# EAGLE design powerboard (EAGLE 7.6.0)
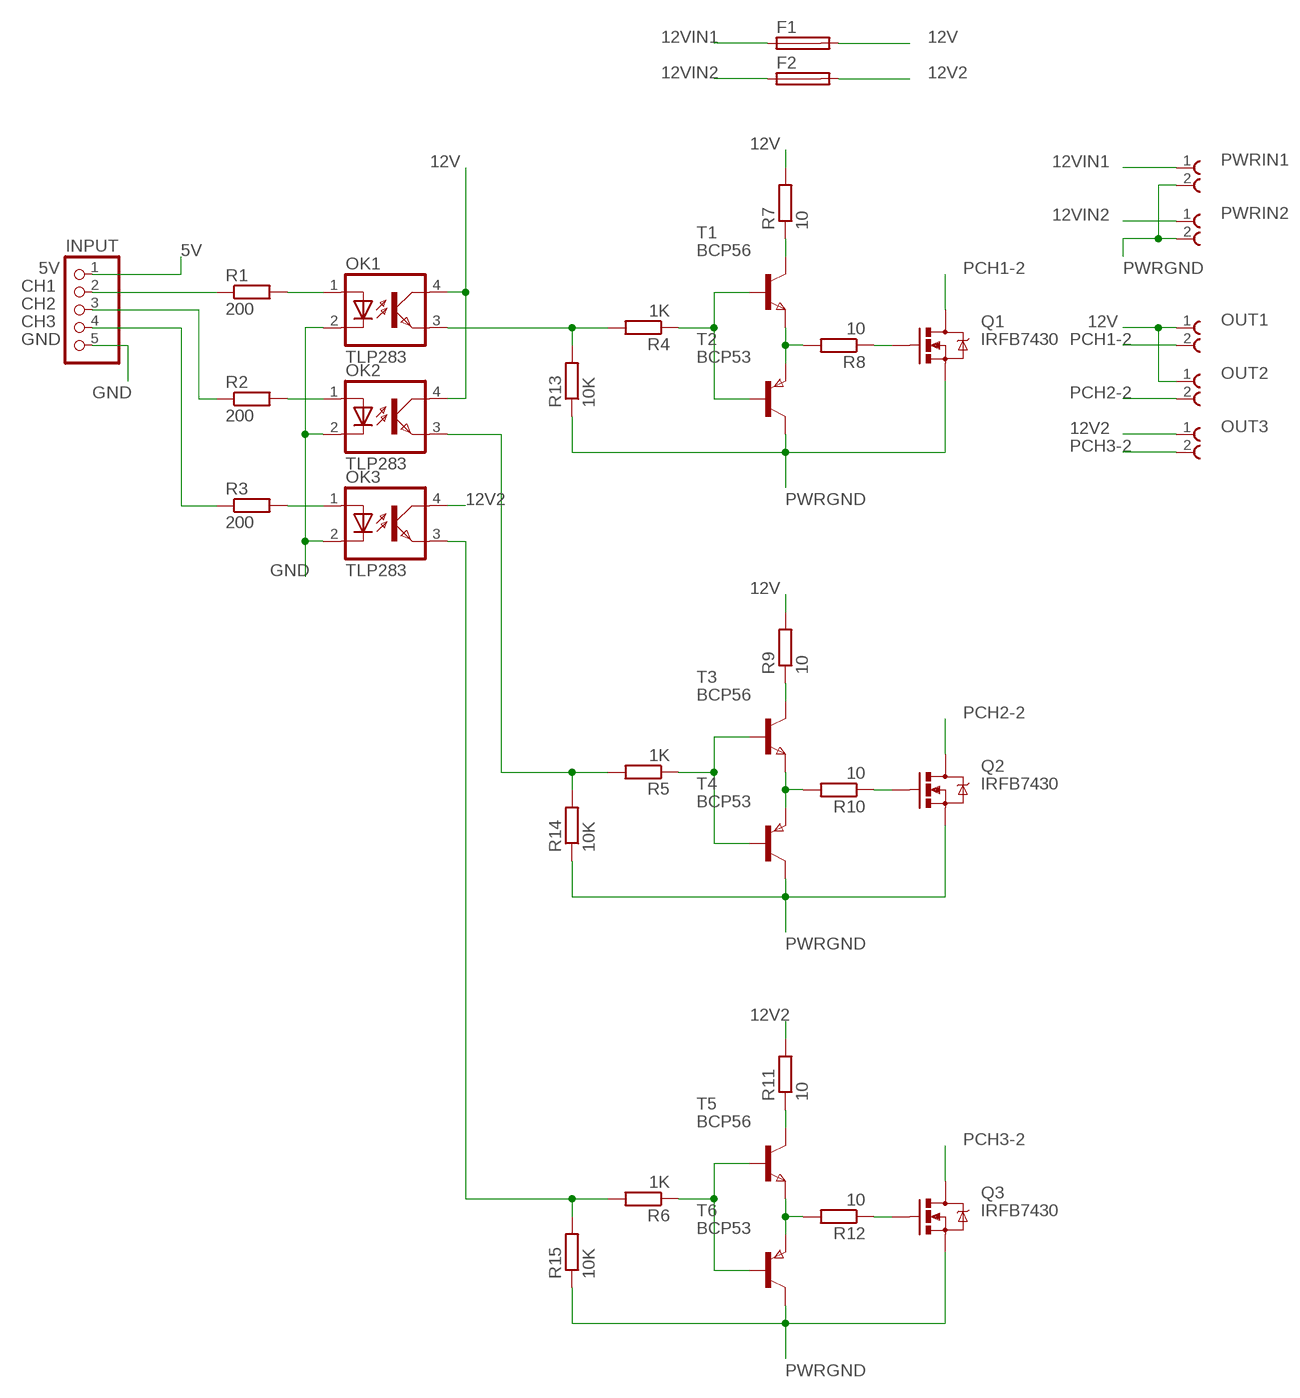
[diagram p0: schematic, sheet 1]

## Parts
F1  SH22,5  [SH22,5]
F2  SH22,5  [SH22,5]
INPUT  PINHD-1X5  [1X05]
OK1  TLP283  [MINI-FLAT-4]
OK2  TLP283  [MINI-FLAT-4]
OK3  TLP283  [MINI-FLAT-4]
OUT1  691244610002  [691244610002]
OUT2  691244610002  [691244610002]
OUT3  691244610002  [691244610002]
PWRIN1  691244610002  [691244610002]
PWRIN2  691244610002  [691244610002]
Q1  IRFB7430  MOSFET-NCHANNELFQP30N06L  [TO220V]
Q2  IRFB7430  MOSFET-NCHANNELFQP30N06L  [TO220V]
Q3  IRFB7430  MOSFET-NCHANNELFQP30N06L  [TO220V]
R1  200  R-EU_R0805  [R0805]
R2  200  R-EU_R0805  [R0805]
R3  200  R-EU_R0805  [R0805]
R4  1K  R-EU_R0805  [R0805]
R5  1K  R-EU_R0805  [R0805]
R6  1K  R-EU_R0805  [R0805]
R7  10  R-EU_R0805  [R0805]
R8  10  R-EU_R0805  [R0805]
R9  10  R-EU_R0805  [R0805]
R10  10  R-EU_R0805  [R0805]
R11  10  R-EU_R0805  [R0805]
R12  10  R-EU_R0805  [R0805]
R13  10K  R-EU_R0805  [R0805]
R14  10K  R-EU_R0805  [R0805]
R15  10K  R-EU_R0805  [R0805]
T1  BCP56  NPNSOT223  [SOT223]
T2  BCP53  PNPSOT223  [SOT223]
T3  BCP56  NPNSOT223  [SOT223]
T4  BCP53  PNPSOT223  [SOT223]
T5  BCP56  NPNSOT223  [SOT223]
T6  BCP53  PNPSOT223  [SOT223]

## Nets
5V: INPUT.1
12V: F1.2 OK1.4(COL) OK2.4(COL) OUT1.1 OUT2.1 R7.2 R9.2
12V2: F2.2 OK3.4(COL) OUT3.1 R11.2
12VIN1: F1.1 PWRIN1.1
12VIN2: F2.1 PWRIN2.1
CH1: INPUT.2 R1.1
CH2: INPUT.3 R2.1
CH3: INPUT.4 R3.1
GND: INPUT.5 OK1.2(C) OK2.2(C) OK3.2(C)
N$1: OK1.1(A) R1.2
N$2: OK2.1(A) R2.2
N$3: R8.2 T1.3(E) T2.3(E)
N$4: OK3.1(A) R3.2
N$5: R4.1 T1.1(B) T2.1(B)
N$6: R5.1 T3.1(B) T4.1(B)
N$7: OK1.3(EMIT) R4.2 R13.2
N$8: R7.1 T1.2(C) T1.4(C)
N$9: Q1.1(G) R8.1
N$10: R10.2 T3.3(E) T4.3(E)
N$11: OK3.3(EMIT) R6.2 R15.2
N$12: R9.1 T3.2(C) T3.4(C)
N$13: Q2.1(G) R10.1
N$14: R12.2 T5.3(E) T6.3(E)
N$15: R6.1 T5.1(B) T6.1(B)
N$16: R11.1 T5.2(C) T5.4(C)
N$17: Q3.1(G) R12.1
N$18: OK2.3(EMIT) R5.2 R14.2
PCH1-2: OUT1.2 Q1.2(D)
PCH2-2: OUT2.2 Q2.2(D)
PCH3-2: OUT3.2 Q3.2(D)
PWRGND: PWRIN1.2 PWRIN2.2 Q1.3(S) Q2.3(S) Q3.3(S) R13.1 R14.1 R15.1 T2.2(C) T2.4(C) T4.2(C) T4.4(C) T6.2(C) T6.4(C)

## Library data of the parts
F1 F2 = fuse:SH22,5: FUSE HOLDER grid 22,5 mm, OGN0031 8201, Schurter (Buerklin); MF: SCHURTER; MPN: 0031.8201; OC_FARNELL: 1162740; OC_NEWARK: 96F8317
INPUT = pinhead:PINHD-1X5: PIN HEADER
OK1-OK3 = optocoupler:TLP283: TOSHIBA PHOTOCOUPLER GaAs IRED & PHOTO-TRANSISTOR Source: http://www.semicon.toshiba.co.jp/td/en/Opto/Photocoupler/en_20050928_TLP283_datasheet.pdf; OC_FARNELL: unknown; OC_NEWARK: unknown
OUT1-OUT3 PWRIN1 PWRIN2 = Terminal_Blocks_Connectors_rev15e:691244610002: SERIE 2445 - 10.16 MM - HORIZONTAL CABLE ENTRY WITH RISING CAGE CLAMP - WR-TBL =>ConTBL2 691244610002 Characteristics INSULATOR:PA6/66 FLAMABILITY RATING: UL94V0 COLOR: GREEN METAL HOUSING: COPPER ALLOY / Ni+Sn TERMINAL SCREW: STEEL / Zn WIRE GUARD: COPPER ALLOY / Ni+Sn OPERATING TEMPERATURE:-30°C UP TO +120°C COMPLIANCE: LEAD FREE AND ROHS ELECTRICAL UL VDE CURRENT RATING: 16A 24A WORKING VOLTAGE: 300VAC 750VAC WITHSTANDING VOLTAGE: 1,6KV 3KV CONTACT RESISTANCE: 20 mOhm max <http://katalog.we-online.de/media/images/v2/Family_TBL_10_16_2446_HORIZONTAL_CABLE_ENTRY_W_RISING_CLAMP_69124461000X.jpg> Details see: http://katalog.we-online.de/en/em/TBL_10_16_2446_HORIZONTAL_CABLE_ENTRY_W_RISING_CLAMP_69124461000X/691244610002 2015 (C) Wurth Elektronik
Q1-Q3 = SparkFun-DiscreteSemi:MOSFET-NCHANNEL: Common NMOSFET Parts MFG P/N Store ID Prod ID FDD8780 TRANS-09984 SI7820DN TRANS-11055 FDS6630A IC-08089 2N7002PW TRANS-11151 FQP30N06L COM-10213 TRANS-10060 BSS123LT1G TRANS-08345 BSS138 TRANS-00830 BS170 2N7000; PROD_ID: TRANS-10060
R1-R15 = rcl:R-EU_: RESISTOR, European symbol
T1 T3 T5 = zetex:NPNSOT223: NPN TRANSISTOR; MPN: DJT4031N-13; OC_FARNELL: 1710672; OC_NEWARK: 25R4490
T2 T4 T6 = zetex:PNPSOT223: PNP TRANSISTOR; MPN: DJT4030P-13; OC_FARNELL: 1710675; OC_NEWARK: 25R4489

## Board
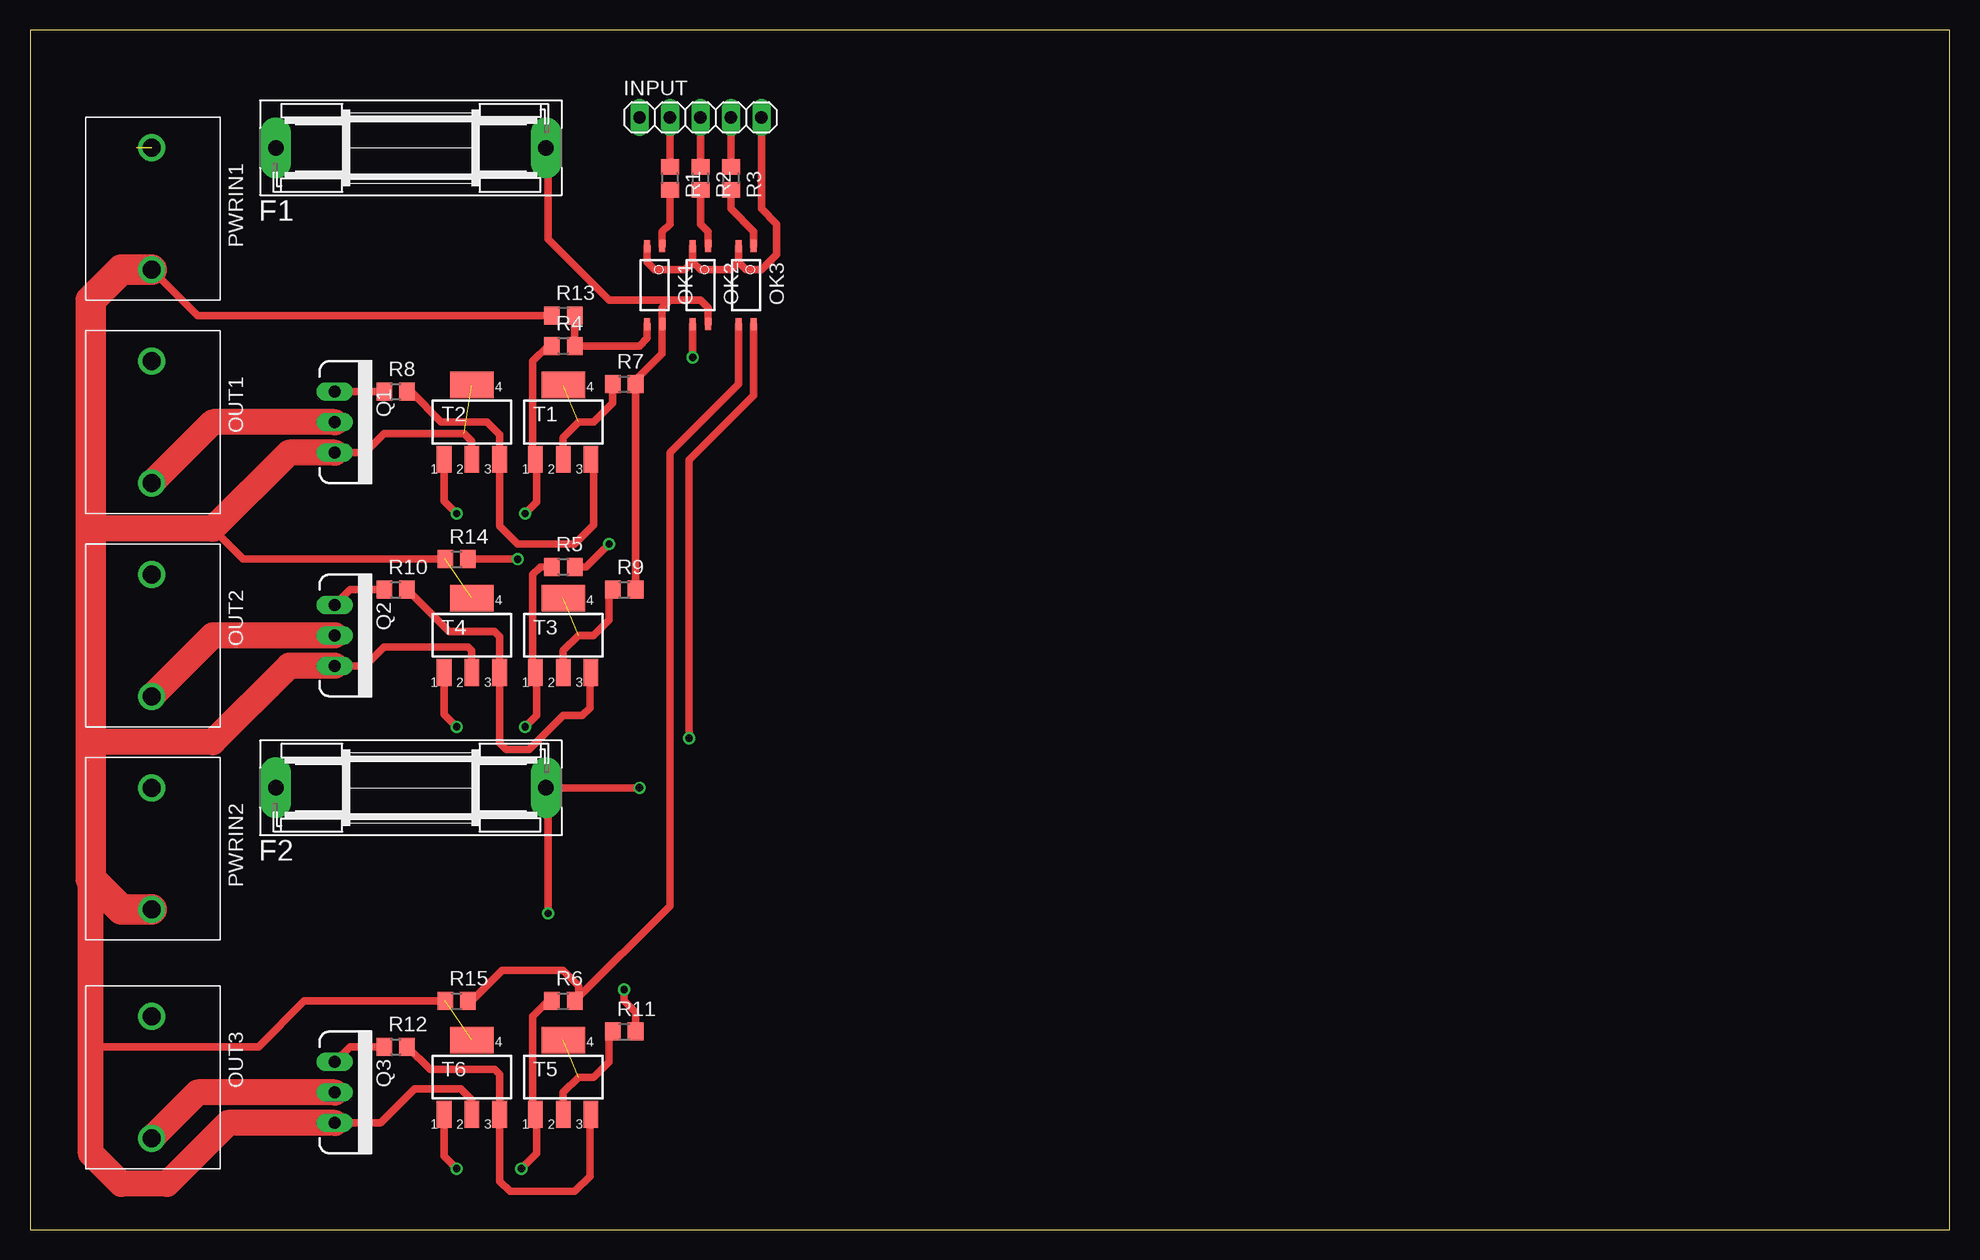
[diagram p1: board, top side]
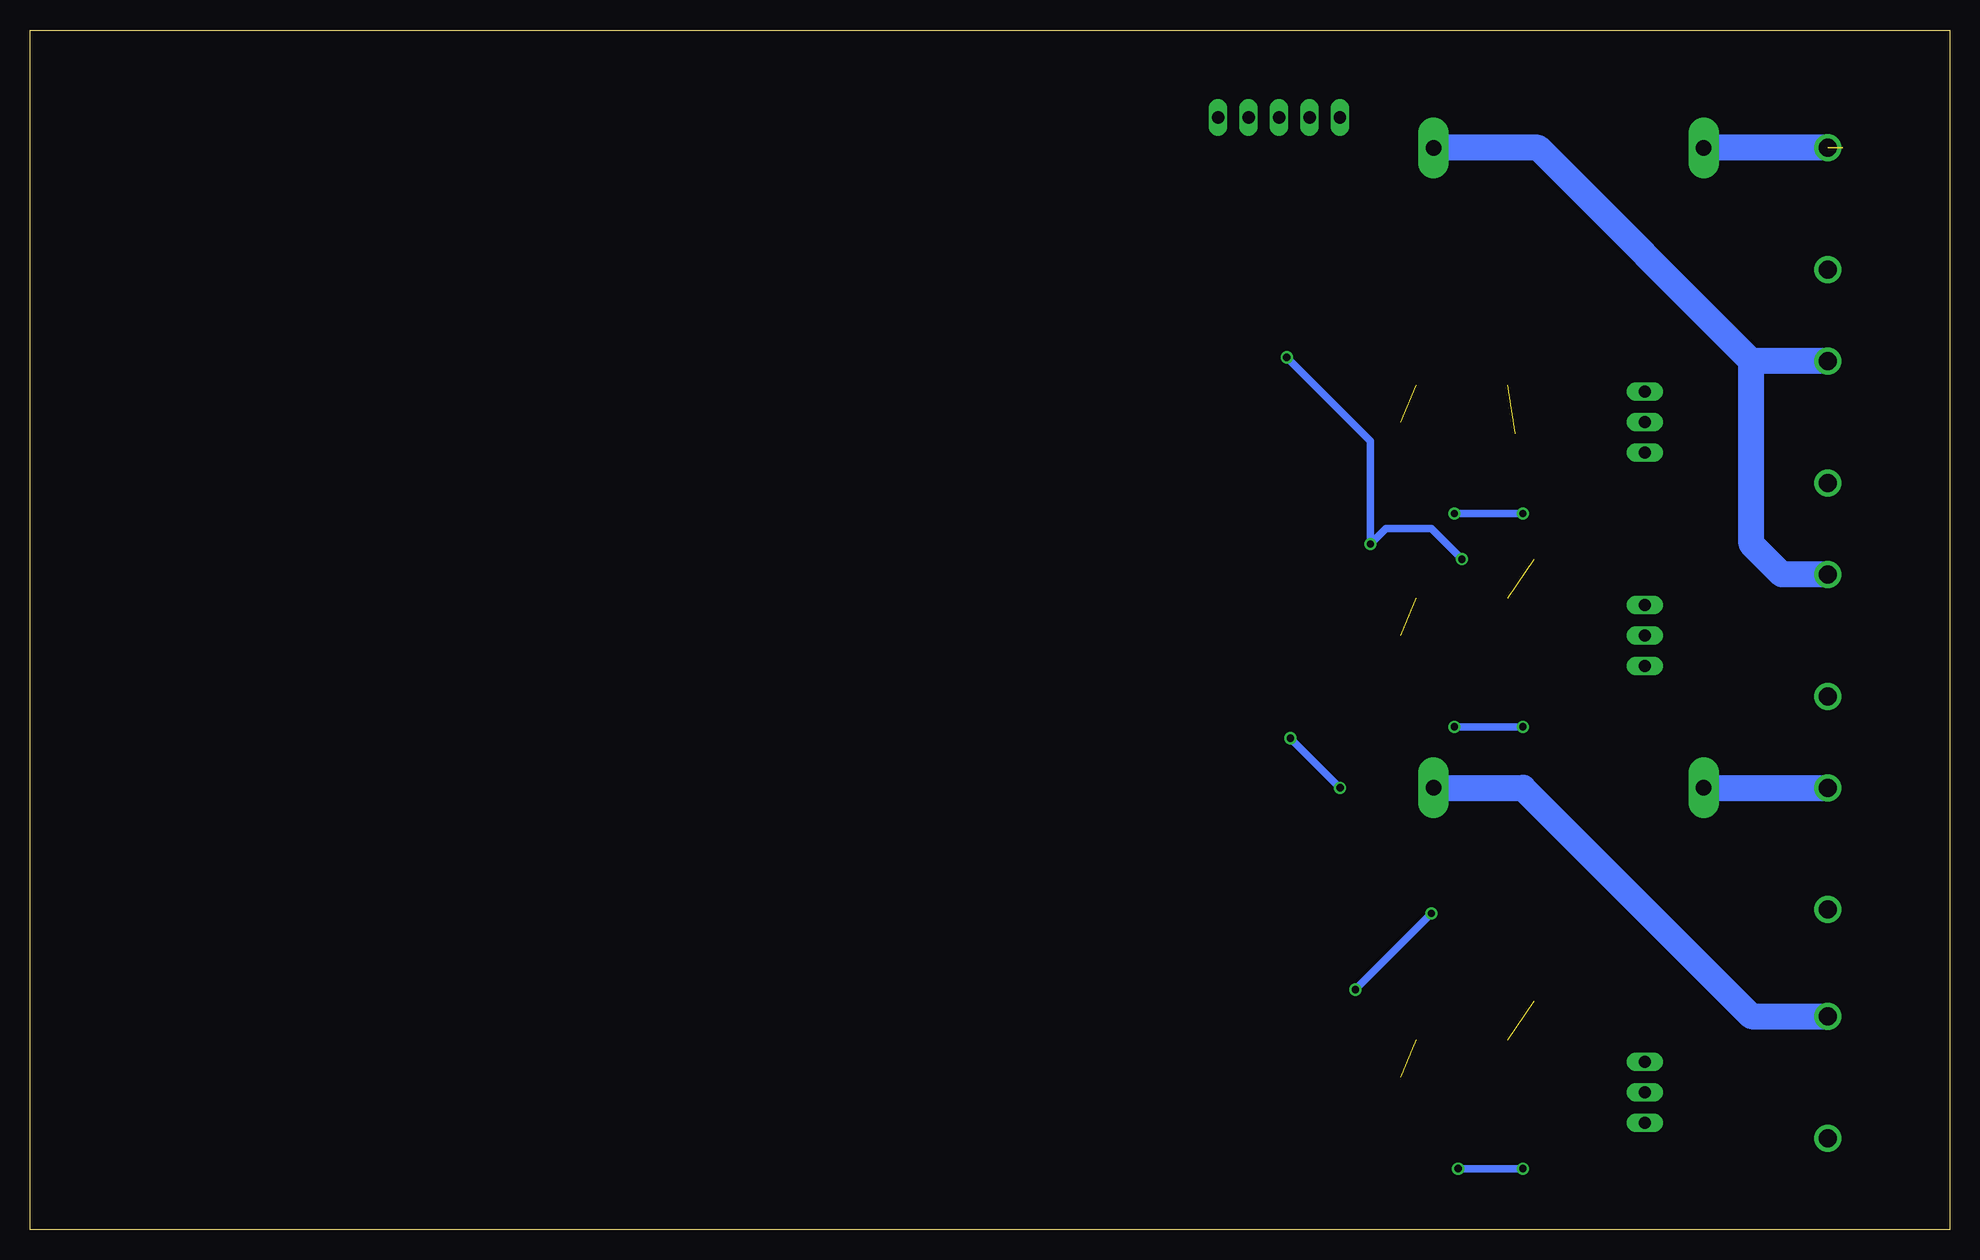
[diagram p2: board, bottom side, seen from below]

Size 160 x 100 mm. Coordinates in mm from the lower left corner, seen from the top.
Outline: 0,0 160,0 160,100 0,100 0,0
Copper layers (1*16): Top 0.035mm / dielectric 1.5mm / Bottom 0.035mm
Design rules "default": minimum track width 10mil, minimum drill 24mil, track to track 8mil, track to pad 8mil, pad to pad 8mil, via to via 8mil, smd to smd 8mil, copper to edge 40mil, drill to drill 8mil, minimum pad ring 10mil, minimum via ring 8mil, stop-mask expansion 4mil, vias tented up to drill 0mil, thermal gap 10mil

### Footprints (pad centres in the part's own frame; a part is rotated, then mirrored left to right if it is on the bottom)
SH22,5 = drill 1.321 pad 2.54 long: 1 -11.252,0; 2 11.252,0
1X05 = drill 1.016 long: 1 -5.08,0; 2 -2.54,0; 3 0,0; 4 2.54,0; 5 5.08,0
MINI-FLAT-4 = smd 1 x 0.5: 1 -3.24,0.635; 2 -3.24,-0.635; 3 3.24,-0.635; 4 3.24,0.635
691244610002 = drill 1.5: 1 -5.08,0; 2 5.08,0
TO220V = drill 1.016 long: 1 -2.54,0; 2 0,0; 3 2.54,0
R0805 = smd 1.3 x 1.5: 1 -0.95,0; 2 0.95,0
SOT223 = smd 1.219 x 2.235: 1 -2.311,-3.099; 2 0,-3.099; 3 2.311,-3.099 | smd 3.6 x 2.2: 4 0,3.099

### Placement (x,y rotation side)
F1  31.75,90.17 0 top
F2  31.75,36.83 0 top
INPUT  55.88,92.71 0 top
OK1  52.07,78.74 270 top
OK2  55.88,78.74 270 top
OK3  59.69,78.74 270 top
OUT1  10.16,67.31 270 top
OUT2  10.16,49.53 270 top
OUT3  10.16,12.7 270 top
PWRIN1  10.16,85.09 270 top
PWRIN2  10.16,31.75 270 top
Q1  25.4,67.31 270 top
Q2  25.4,49.53 270 top
Q3  25.4,11.43 270 top
R1  53.34,87.63 270 top
R2  55.88,87.63 270 top
R3  58.42,87.63 270 top
R4  44.45,73.66 0 top
R5  44.45,55.24 0 top
R6  44.45,19.05 0 top
R7  49.53,70.48 0 top
R8  30.48,69.85 0 top
R9  49.53,53.34 0 top
R10  30.48,53.34 0 top
R11  49.53,16.51 0 top
R12  30.48,15.24 0 top
R13  44.45,76.2 0 top
R14  35.56,55.88 0 top
R15  35.56,19.05 0 top
T1  44.45,67.31 0 top
T2  36.83,67.31 0 top
T3  44.45,49.53 0 top
T4  36.83,49.53 0 top
T5  44.45,12.7 0 top
T6  36.83,12.7 0 top

### Tracks (layer width: path | path; a pad name or v marks a point on that pad's centre or on a via)
12V
  Top 0.61: 53.34,77.47 52.7,76.83 OK1.4 52.7,73.03 50.48,70.8 R7.2 R9.2 | 53.34,77.47 55.88,77.47 56.52,76.83 OK2.4 | 53.34,77.47 48.26,77.47 43.18,82.55 43.18,89.99 F1.2
  Bottom 2.184: OUT1.1 16.51,72.39 | 16.51,72.39 34.29,90.17 F1.2 | OUT2.1 13.97,54.61 16.51,57.15 16.51,72.39
12V2  (via drill 0.6)
  Top 0.61: R11.2 50.48,18.1 49.53,19.05 v49.53,20 | v43.18,26.35 43.18,36.65 F2.2 v50.8,36.83 | OK3.4 60.33,69.53 54.93,64.14 v54.93,40.96
  Bottom 0.61: v49.53,20 v43.18,26.35 | v54.93,40.96 v50.8,36.83
  Bottom 2.184: F2.2 35.56,36.83 16.51,17.78 OUT3.1
12VIN1  (2 unrouted)
  Bottom 2.184: PWRIN1.1 F1.1
12VIN2
  Bottom 2.184: F2.1 PWRIN2.1
CH1
  Top 0.61: INPUT.2 R1.1
CH2
  Top 0.61: INPUT.3 R2.1
CH3
  Top 0.61: INPUT.4 R3.1
GND
  Top 0.61: OK1.2 51.44,80.64 52.07,80.01 54.61,80.01 55.24,80.64 | OK2.2 55.24,80.64 | 55.24,80.64 55.88,80.01 58.42,80.01 59.05,80.64 | 59.05,80.64 OK3.2 | INPUT.5 60.96,85.09 62.23,83.82 62.23,81.28 60.96,80.01 59.69,80.01 59.05,80.64
N$1
  Top 0.61: R1.2 53.34,83.82 52.7,83.19 OK1.1
N$2
  Top 0.61: R2.2 55.88,83.82 56.52,83.19 OK2.1
N$3
  Top 0.61: R8.2 31.75,69.85 34.29,67.31 38.1,67.31 39.14,66.27 T2.3 39.14,58.65 40.64,57.15 45.4,57.15 46.99,58.74 46.99,63.98 T1.3
N$4
  Top 0.61: R3.2 58.42,85.09 60.33,83.19 OK3.1
N$5  (via drill 0.6)
  Top 0.61: R4.1 43.18,73.66 41.91,72.39 41.91,64.44 T1.1 42.23,64.12 42.23,60.64 v41.27,59.69 | T2.1 34.52,60.73 v35.56,59.69
  Bottom 0.61: v35.56,59.69 v41.27,59.69
N$6  (via drill 0.6)
  Top 0.61: T4.1 34.52,42.95 v35.56,41.91 | v41.27,41.91 42.23,42.86 42.23,46.34 T3.1 41.91,46.66 41.91,54.61 42.55,55.24 R5.1
  Bottom 0.61: v35.56,41.91 v41.27,41.91
N$7
  Top 0.61: OK1.3 51.44,74.3 50.8,73.66 R4.2 R13.2
N$8  (1 unrouted)
  Top 0.61: R7.1 48.58,68.9 46.99,67.31 45.72,67.31 44.45,66.04 T1.2
N$9
  Top 0.61: R8.1 Q1.1
N$10
  Top 0.61: R10.2 34.92,49.85 38.73,49.85 39.14,49.44 T4.3 39.14,40.55 39.69,40.01 41.59,40.01 44.45,42.86 46.04,42.86 46.67,43.5 46.67,46.34 T3.3
N$11
  Top 0.61: OK3.3 59.05,70.48 53.34,64.77 53.34,26.99 R6.2 45.72,19.37 45.72,20.32 44.45,21.59 39.37,21.59 36.83,19.05 R15.2
N$12  (1 unrouted)
  Top 0.61: T3.2 44.45,48.26 45.72,49.53 46.99,49.53 48.26,50.8 48.26,53.02 R9.1
N$13
  Top 0.61: R10.1 26.67,53.34 Q2.1
N$14
  Top 0.61: 31.75,15.24 R12.2 33.34,13.34 38.73,13.34 39.14,12.93 T6.3 39.14,4.04 40.01,3.17 45.4,3.17 46.67,4.45 46.67,9.51 T5.3
N$15  (via drill 0.6)
  Top 0.61: T6.1 34.52,6.12 v35.56,5.08 | v40.96,5.08 42.23,6.35 42.23,9.51 T5.1 41.91,9.83 41.91,17.78 43.18,19.05 R6.1
  Bottom 0.61: v35.56,5.08 v40.96,5.08
N$16  (1 unrouted)
  Top 0.61: T5.2 44.45,11.43 45.72,12.7 46.99,12.7 48.26,13.97 48.26,16.19 R11.1
N$17
  Top 0.61: R12.1 26.67,15.24 Q3.1
N$18  (via drill 0.6)
  Top 0.61: R5.2 46.35,55.24 v48.26,57.15 | v55.24,72.71 OK2.3 | R14.2 v40.64,55.88
  Bottom 0.61: v55.24,72.71 48.26,65.72 v48.26,57.15 46.99,58.42 43.18,58.42 v40.64,55.88
PCH1-2
  Top 2.184: Q1.2 15.24,67.31 OUT1.2
PCH2-2
  Top 2.184: Q2.2 15.24,49.53 OUT2.2
PCH3-2
  Top 2.184: Q3.2 13.97,11.43 OUT3.2
PWRGND  (3 unrouted)
  Top 0.61: T2.2 36.83,65.72 36.2,66.36 29.53,66.36 27.94,64.77 Q1.3 | R13.1 13.97,76.2 PWRIN1.2 | T4.2 36.83,48.26 36.51,48.58 29.53,48.58 27.94,46.99 Q2.3 | T6.2 36.83,10.79 35.88,11.75 32.07,11.75 29.21,8.89 Q3.3 | R14.1 17.78,55.88 15.24,58.42 | R15.1 22.86,19.05 19.05,15.24 5.08,15.24
  Top 2.184: Q1.3 21.59,64.77 15.24,58.42 5.08,58.42 | Q2.3 21.59,46.99 15.24,40.64 5.08,40.64 | Q3.3 16.51,8.89 11.43,3.81 7.62,3.81 5.08,6.35 5.08,15.24 5.08,30.48
  Top 2.54: PWRIN2.2 7.62,26.67 5.08,29.21 5.08,30.48 5.08,40.64 5.08,58.42 5.08,77.47 7.62,80.01 PWRIN1.2